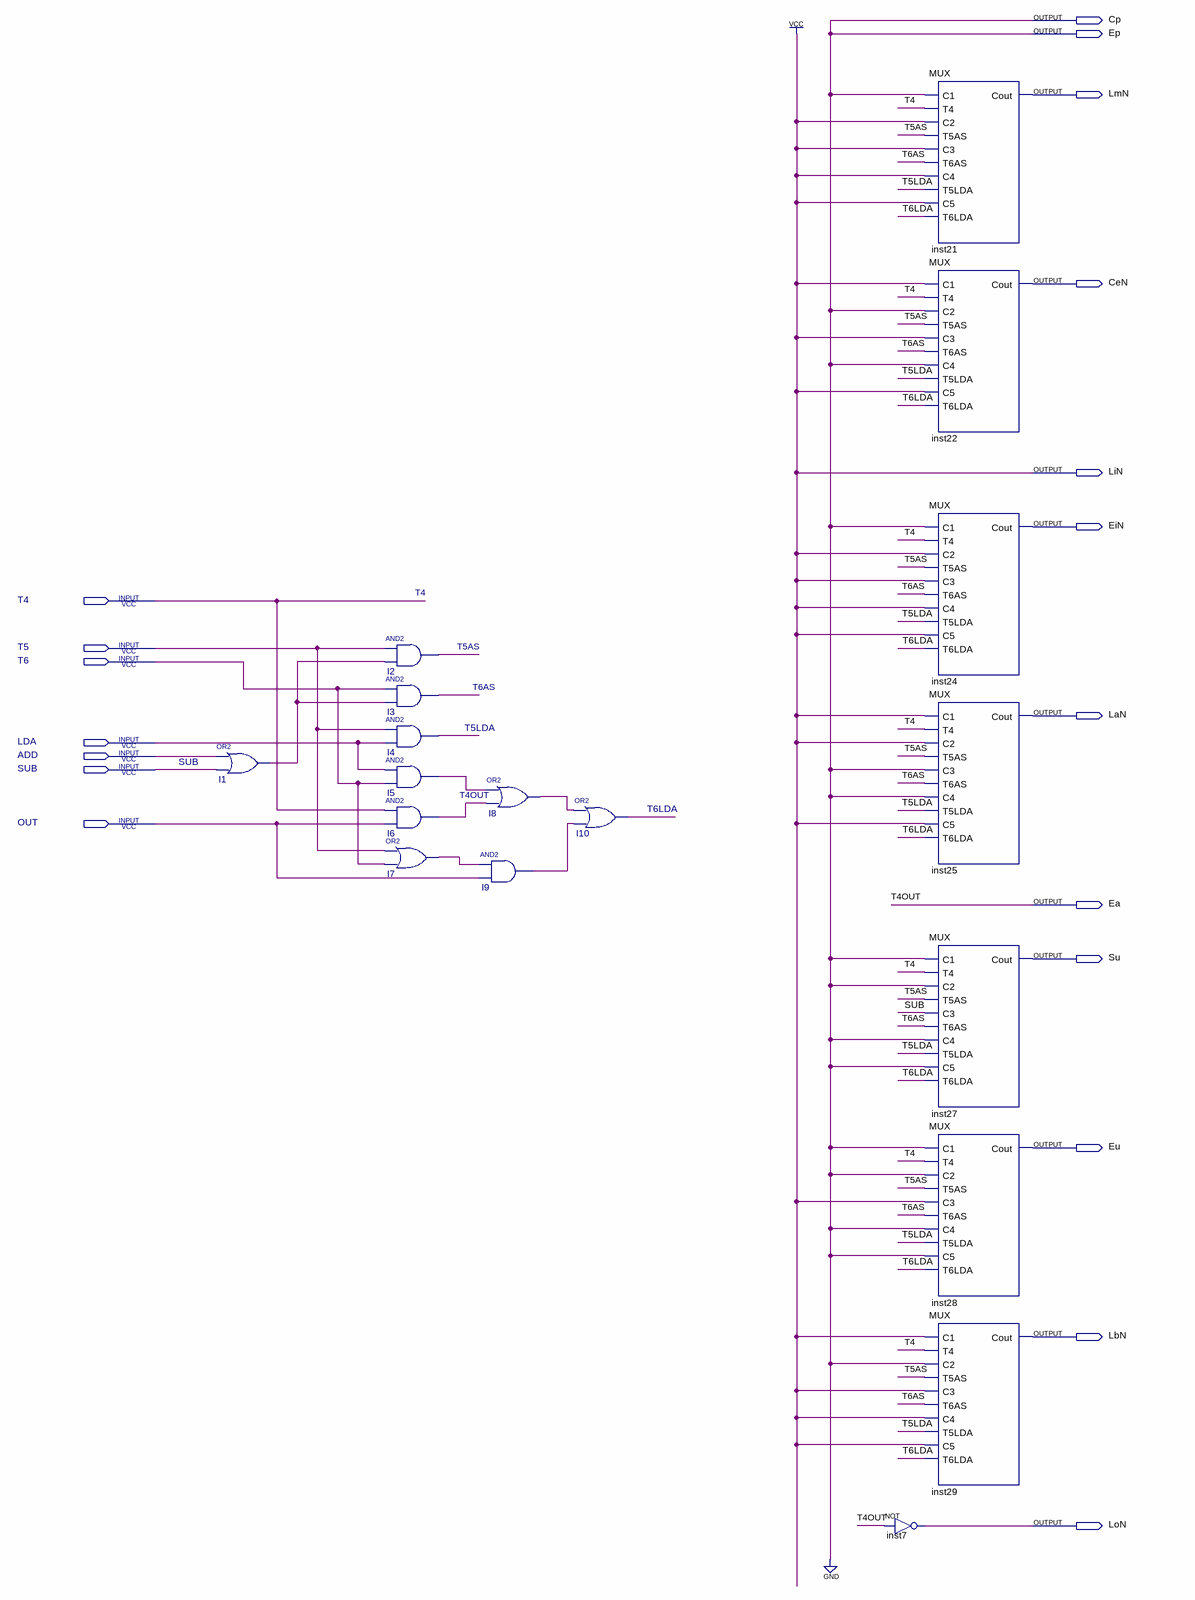
[diagram p0: schematic sheet]
// Quartus schematic Ciclo-Execucao.bdf as structural Verilog: 18 symbols, 19 pins
module \Ciclo-Execucao  (
  input  T4,
  input  T5,
  input  T6,
  input  LDA,
  input  ADD,
  input  SUB,
  input  OUT,
  output Cp,
  output Ep,
  output LmN,
  output CeN,
  output LiN,
  output EiN,
  output LaN,
  output Ea,
  output Su,
  output Eu,
  output LbN,
  output LoN
);

  wire I1_out, I5_out, I7_out, I8_out, I9_out, T5AS, T5LDA, T6AS, T6LDA;

  or I1 (I1_out, ADD, SUB);
  and I2 (T5AS, T5, I1_out);
  and I3 (T6AS, T6, I1_out);
  and I4 (T5LDA, T5, LDA);
  and I5 (I5_out, LDA, T6);
  and I6 (Ea, T4, OUT);
  or I7 (I7_out, T5, T6);
  or I8 (I8_out, I5_out, Ea);
  and I9 (I9_out, I7_out, OUT);
  or I10 (T6LDA, I8_out, I9_out);
  not inst7 (LoN, Ea);
  MUX inst21 (
    .C1(1'b0), .T4(T4), .C2(1'b1), .T5AS(T5AS), .C3(1'b1), .T6AS(T6AS), .C4(1'b1), .T5LDA(T5LDA), .C5(1'b1),
    .T6LDA(T6LDA), .Cout(LmN));
  MUX inst22 (
    .C1(1'b1), .T4(T4), .C2(1'b0), .T5AS(T5AS), .C3(1'b1), .T6AS(T6AS), .C4(1'b0), .T5LDA(T5LDA), .C5(1'b1),
    .T6LDA(T6LDA), .Cout(CeN));
  MUX inst24 (
    .C1(1'b0), .T4(T4), .C2(1'b1), .T5AS(T5AS), .C3(1'b1), .T6AS(T6AS), .C4(1'b1), .T5LDA(T5LDA), .C5(1'b1),
    .T6LDA(T6LDA), .Cout(EiN));
  MUX inst25 (
    .C1(1'b1), .T4(T4), .C2(1'b1), .T5AS(T5AS), .C3(1'b0), .T6AS(T6AS), .C4(1'b0), .T5LDA(T5LDA), .C5(1'b1),
    .T6LDA(T6LDA), .Cout(LaN));
  MUX inst27 (
    .C1(1'b0), .T4(T4), .C2(1'b0), .T5AS(T5AS), .C3(SUB), .T6AS(T6AS), .C4(1'b0), .T5LDA(T5LDA), .C5(1'b0),
    .T6LDA(T6LDA), .Cout(Su));
  MUX inst28 (
    .C1(1'b0), .T4(T4), .C2(1'b0), .T5AS(T5AS), .C3(1'b1), .T6AS(T6AS), .C4(1'b0), .T5LDA(T5LDA), .C5(1'b0),
    .T6LDA(T6LDA), .Cout(Eu));
  MUX inst29 (
    .C1(1'b1), .T4(T4), .C2(1'b0), .T5AS(T5AS), .C3(1'b1), .T6AS(T6AS), .C4(1'b1), .T5LDA(T5LDA), .C5(1'b1),
    .T6LDA(T6LDA), .Cout(LbN));

  assign Cp = 1'b0;
  assign Ep = 1'b0;
  assign LiN = 1'b1;

  // Other names for the same wires on the sheet: T4OUT = Ea
endmodule
